# EAGLE design lm3410-sepic-led-driver-16mm-mk-3-led (EAGLE 6.4)
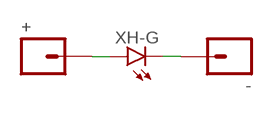
[diagram p0: schematic, sheet 1]

## Parts
+  M01PTH-1.2MM  [1X01-1.2MM]
-  M01PTH-1.2MM-NS  [1X01-1.2MM-NS]
XH-G  LEDBIG-ASS-RED-LED  [LED-GULL-WINGS-MINE-MINE-MINE]

## Nets
GND: -.P$1 XH-G.K(C) XH-G.K@1(C) XH-G.K@3(C) XH-G.K@4(C) XH-G.K@5(C) XH-G.K@7(C) XH-G.K@8(C) XH-G.K@9(C) XH-G.K@10(C) XH-G.K@11(C) XH-G.K@12(C) XH-G.K@13(C) XH-G.K@14(C) XH-G.K@15(C) XH-G.K@16(C) XH-G.K@17(C) XH-G.K@18(C) XH-G.K@19(C) XH-G.K@20(C) XH-G.K@21(C) XH-G.K@23(C) XH-G.K@24(C) XH-G.K@25(C)
VCC: +.P$1 XH-G.A

## Library data of the parts
+ - = A_butts:M01: Header 1 Standard 1-pin 0.1" header. Use with straight break away headers (SKU : PRT-00116), right angle break away headers (PRT-00553), swiss pins (PRT-00743), machine pins (PRT-00117), and female headers (PRT-00115).
XH-G = A_butts:LED: LEDs Standard schematic elements and footprints for 5mm, 3mm, 1206, and 0603 sized LEDs. 5mm - Spark Fun Electronics SKU : COM-00529 (and others)

## Board
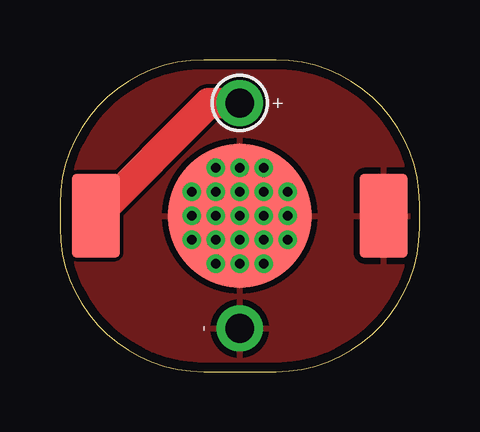
[diagram p1: board, top side]
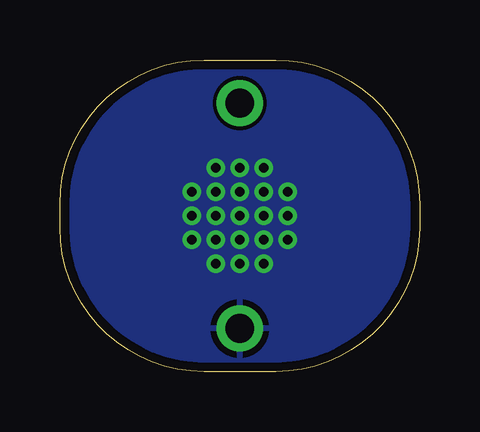
[diagram p2: board, bottom side, seen from below]

Size 15 x 13 mm. Coordinates in mm from the lower left corner, seen from the top.
Outline: 0,7 0,6 arc90 6,0 9,0 arc90 15,6 15,7 arc90 9,13 6,13 arc90 0,7
Copper layers (1*16): Top 0.0356mm / dielectric 1.5011mm / Bottom 0.0356mm
Design rules "LaenPCBOrder2": minimum track width 6mil, minimum drill 13mil, track to track 6mil, track to pad 6mil, pad to pad 6mil, via to via 6mil, smd to smd 6mil, copper to edge 15mil, drill to drill 6mil, minimum pad ring 7mil, minimum via ring 7mil, stop-mask expansion 3mil, vias tented up to drill 20mil, thermal gap 10mil

### Footprints (pad centres in the part's own frame; a part is rotated, then mirrored left to right if it is on the bottom)
1X01-1.2MM = drill 1.2 pad 1.93: P$1 0,0
1X01-1.2MM-NS = drill 1.2 pad 1.93: P$1 0,0
LED-GULL-WINGS-MINE-MINE-MINE = smd 2 x 3.5: A -6,0; K 6,0 | smd 6 x 6: K@1 0,0 | drill 0.4: K@3 -1,-2; K@4 0,-2; K@5 1,-2; K@7 -2,-1; K@8 -1,-1; K@9 0,-1; K@10 1,-1; K@11 2,-1; K@12 -2,0; K@13 -1,0; K@14 0,0; K@15 1,0; K@16 2,0; K@17 -2,1; K@18 -1,1; K@19 0,1; K@20 1,1; K@21 2,1; K@23 -1,2; K@24 0,2; K@25 1,2

### Placement (x,y rotation side)
+  7.5,11.2 270 top
-  7.5,1.8 90 top
XH-G  7.5,6.5 0 top

### Tracks (layer width: path | path; a pad name or v marks a point on that pad's centre or on a via)
GND
  pour Bottom: 15,7 15,6 arc-90 9,0 6,0 arc-90 0,6 0,7 arc-90 6,13 9,13 arc-90
  pour Top: 15,7 15,6 arc-90 9,0 6,0 arc-90 0,6 0,7 arc-90 6,13 9,13 arc-90
VCC
  Top 1.27: +.P$1 6.2,11.2 XH-G.A